# EAGLE schematic psu (EAGLE 6.4)
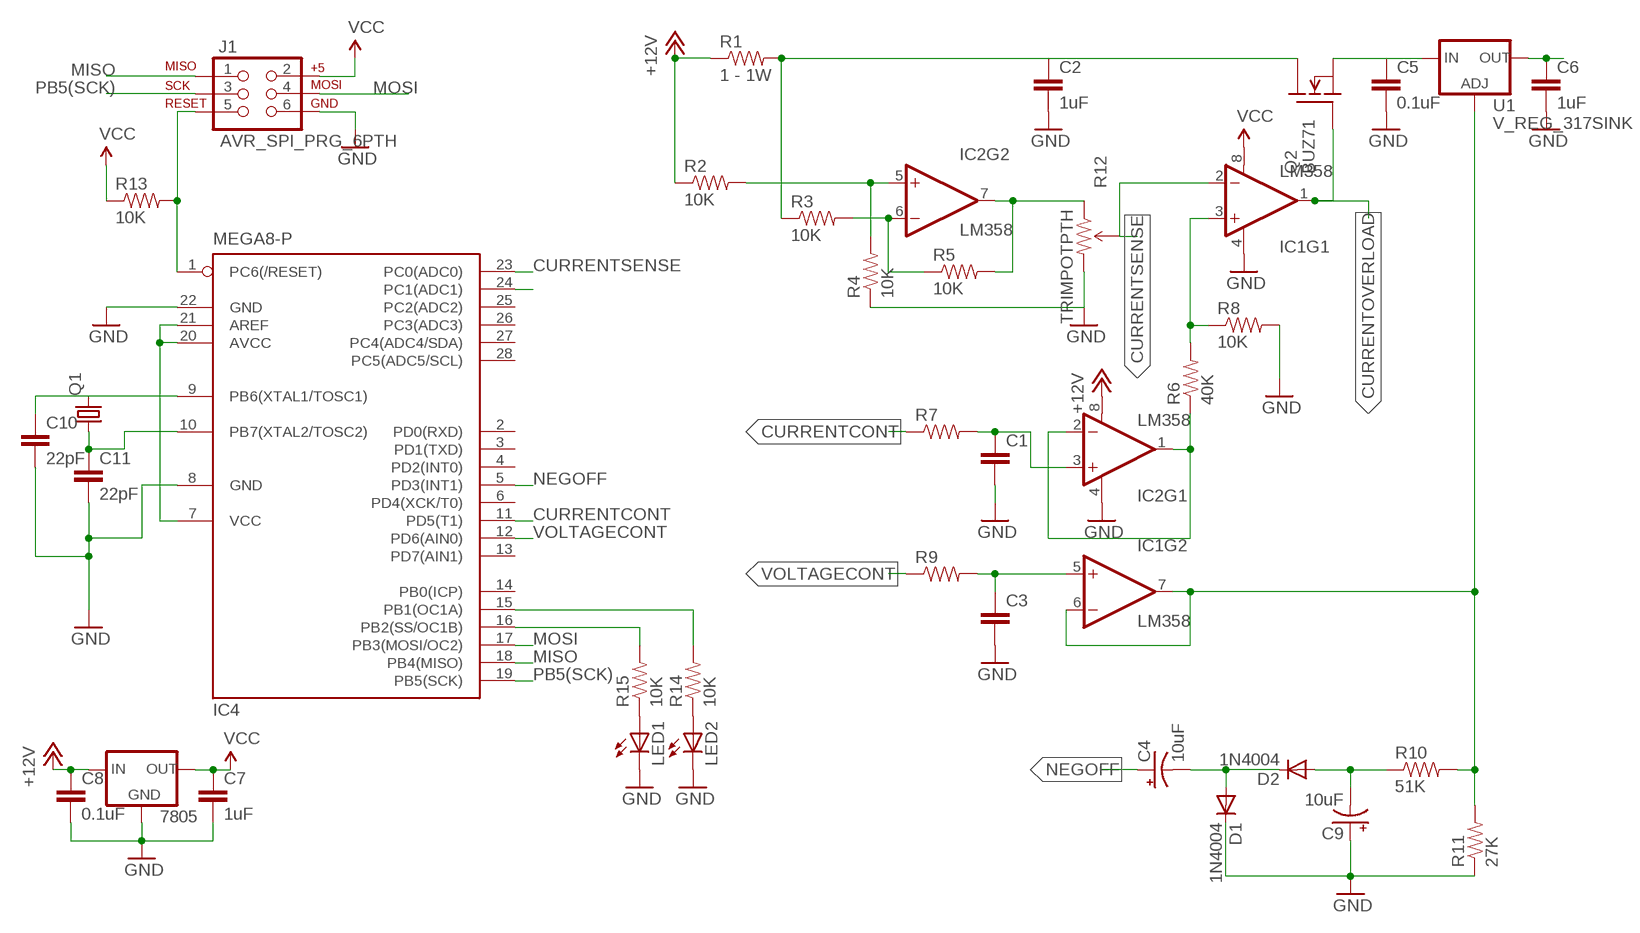
[diagram p0: schematic, sheet 1]

## Parts
7805  V_REG_78XXSINK  [TO220-IGO]
C1  CAPPTH  [CAP-PTH-SMALL]
C2  1uF  CAPPTH  [CAP-PTH-SMALL]
C3  CAPPTH  [CAP-PTH-SMALL]
C4  10uF  CAP_POLPTH2  [CPOL-RADIAL-10UF-25V]
C5  0.1uF  CAPPTH  [CAP-PTH-SMALL]
C6  1uF  CAPPTH  [CAP-PTH-SMALL]
C7  1uF  CAPPTH  [CAP-PTH-SMALL]
C8  0.1uF  CAPPTH  [CAP-PTH-SMALL]
C9  10uF  CAP_POLPTH2  [CPOL-RADIAL-10UF-25V]
C10  22pF  CAP0805  [0805]
C11  22pF  CAP0805  [0805]
D1  1N4004  [DO41-10]
D2  1N4004  [DO41-10]
IC1  LM358  [DIP08]
IC2  LM358  [DIP08]
IC4  MEGA8-P  [DIL28-3]
J1  AVR_SPI_PRG_6PTH  [2X3]
LED1  LED5MM  [LED5MM]
LED2  LED5MM  [LED5MM]
Q1  CRYSTALHC49UP  [HC49UP]
Q2  BUZ71  [TO220]
R1  1 - 1W  RESISTORPTH-1/4W  [AXIAL-0.4]
R2  10K  RESISTORPTH-1/4W  [AXIAL-0.4]
R3  10K  RESISTORPTH-1/4W  [AXIAL-0.4]
R4  10K  RESISTORPTH-1/4W  [AXIAL-0.4]
R5  10K  RESISTORPTH-1/4W  [AXIAL-0.4]
R6  40K  RESISTORPTH-1/4W  [AXIAL-0.4]
R7  RESISTORPTH-1/4W  [AXIAL-0.4]
R8  10K  RESISTORPTH-1/4W  [AXIAL-0.4]
R9  RESISTORPTH-1/4W  [AXIAL-0.4]
R10  51K  RESISTORPTH-1/4W  [AXIAL-0.4]
R11  27K  RESISTORPTH-1/4W  [AXIAL-0.4]
R12  TRIMPOTPTH  [TRIM_POT_PTH]
R13  10K  RESISTOR0805-RES  [0805]
R14  10K  RESISTORPTH-1/4W  [AXIAL-0.4]
R15  10K  RESISTORPTH-1/4W  [AXIAL-0.4]
U1  V_REG_317SINK  [TO220-ADJ]

## Nets
+12V: 7805.IN C8.1 IC2.8(V+) R1.P$1 R2.P$1
COUT: IC2.7(OUT) R5.P$2 R12.1(CCW)
CURRENTCONT: IC4.11(PD5(T1)) R7.P$1
CURRENTOVERLOAD: IC1.1(OUT) IC4.24(PC1(ADC1)) Q2.1(G)
CURRENTSENSE: IC1.2(-IN) IC4.23(PC0(ADC0)) R12.2(WIPER)
GND: 7805.GND C1.2 C2.2 C3.2 C5.2 C6.2 C7.2 C8.2 C9.1(+) C10.2 C11.2 D1.C IC1.4(V-) IC2.4(V-) IC4.8(GND) IC4.22(GND) J1.6 LED1.K(C) LED2.K(C) R4.P$1 R8.P$2 R11.P$1 R12.3(CW)
MISO: IC4.18(PB4(MISO)) J1.1
MOSI: IC4.17(PB3(MOSI/OC2)) J1.4
N$1: IC2.6(-IN) R3.P$2 R5.P$1
N$2: IC1.3(+IN) R6.P$2 R8.P$1
N$3: IC2.5(+IN) R2.P$2 R4.P$2
N$4: IC2.1(OUT) IC2.2(-IN) R6.P$1
N$5: IC1.6(-IN) IC1.7(OUT) R10.P$2 R11.P$2 U1.ADJ
N$6: C4.2(-) D1.A D2.C
N$7: C6.1 U1.OUT
N$8: C10.1 IC4.9(PB6(XTAL1/TOSC1)) Q1.2
N$9: C2.1 Q2.2(D) R1.P$2 R3.P$1
N$10: IC4.15(PB1(OC1A)) R14.P$2
N$11: C11.1 IC4.10(PB7(XTAL2/TOSC2)) Q1.1
N$12: IC4.7(VCC) IC4.20(AVCC) IC4.21(AREF)
N$13: C3.1 IC1.5(+IN) R9.P$2
N$14: IC4.1(PC6(/RESET)) J1.5 R13.2
N$15: C9.2(-) D2.A R10.P$1
N$16: C1.1 IC2.3(+IN) R7.P$2
N$17: IC4.16(PB2(SS/OC1B)) R15.P$2
N$18: LED1.A R15.P$1
N$19: LED2.A R14.P$1
N$20: C5.1 Q2.3(S) U1.IN
NEGOFF: C4.1(+) IC4.5(PD3(INT1))
PB5(SCK): IC4.19(PB5(SCK)) J1.3
VCC: 7805.OUT C7.1 IC1.8(V+) J1.2 R13.1
VOLTAGECONT: IC4.12(PD6(AIN0)) R9.P$1
Unconnected: IC4.2(PD0(RXD)) IC4.3(PD1(TXD)) IC4.4(PD2(INT0)) IC4.6(PD4(XCK/T0)) IC4.13(PD7(AIN1)) IC4.14(PB0(ICP)) IC4.25(PC2(ADC2)) IC4.26(PC3(ADC3)) IC4.27(PC4(ADC4/SDA)) IC4.28(PC5(ADC5/SCL))

## Library data of the parts
7805 = SparkFun-PowerIC:V_REG_78XX: Voltage Regulator Standard 7805 5V regulator. IGO (Input Ground Output). Spark Fun Electronics SKU : COM-00107
C1-C3 C5-C8 C10 C11 = SparkFun-Capacitors:CAP: Capacitor Standard 0603 ceramic capacitor, and 0.1" leaded capacitor.
C4 C9 = SparkFun-Capacitors:CAP_POL: Capacitor Polarized These are standard SMD and PTH capacitors. Normally 10uF, 47uF, and 100uF in electrolytic and tantalum varieties. Always verify the external diameter of the through hole cap, it varies with capacity, voltage, and manufacturer. The EIA devices should be standard.
D1 D2 = diode:1N4004: DIODE general purpose rectifier, 1 A
IC1 IC2 = SparkFun-AnalogIC:LM358: Jellybean op-amp; PROD_ID: IC-09172
IC4 = atmel:MEGA8-P: MICROCONTROLLER 8 Kbytes FLASH, 1 kbytes SRAM, 512 bytes EEPROM, USART, 4-channel 10 bit ADC, 2-channel 8 bit ADC Pin compatible with Atmega48, ATMega88, ATMega168 Source: avr.lbr; OC_FARNELL: unknown; OC_NEWARK: unknown
J1 = SparkFun-Connectors:AVR_SPI_PRG_6: AVR ISP 6 Pin This is the reduced ISP connector for AVR programming. Common on Arduino. This footprint will take up less PCB space and can be used with a 10-pin to 6-pin adapter such as SKU: BOB-08508
LED1 LED2 = SparkFun-LED:LED: LEDs Standard schematic elements and footprints for 5mm, 3mm, 1206, and 0603 sized LEDs. 5mm - Spark Fun Electronics SKU : COM-00529 (and others)
Q1 = crystal:CRYSTAL: CRYSTAL; OC_FARNELL: unknown; OC_NEWARK: unknown
Q2 = transistor-fet:BUZ71: N-Channel Enhancement MOSFET 50V; 14A; 0,1Ohm
R1-R11 R14 R15 = SparkFun-Passives:RESISTOR: Resistor Basic schematic elements and footprints for 0603, 1206, and PTH resistors.
R12 = SparkFun-Electromechanical:TRIMPOT: Various small potentiometers for "set-and-forget" applications
R13 = SparkFun-Resistors:RESISTOR: Resistor Basic schematic elements and footprints for 0603, 1206, and PTH resistors.
U1 = SparkFun-PowerIC:V_REG_317: Voltage Regulator Standard LM317 adjustable voltage regulator. AOI (Adjust Output Input). Google 'LM317 Calculator' for easy to use app to get the two resistor values needed. 240/720 for 5V output. 240/390 for 3.3V output. Spark Fun Electronics SKU : COM-00527